# Altium schematic sheet JP_acc.SchDoc
size A4
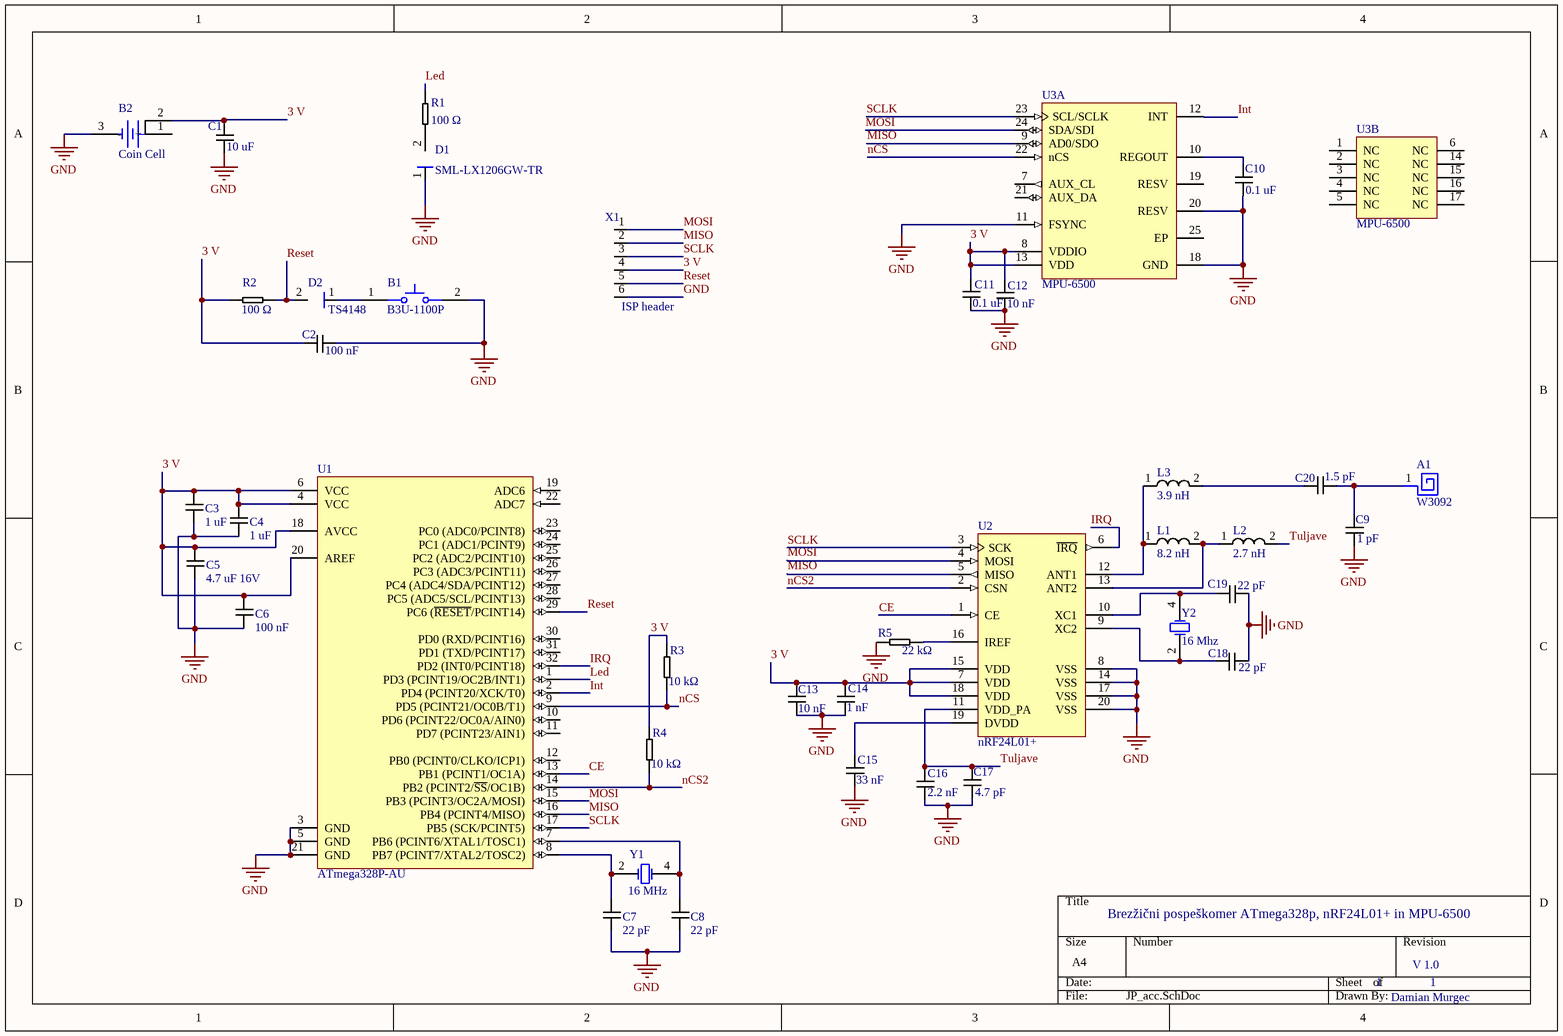
[diagram p0: JP_acc.SchDoc]

## Parts
A1  W3092  [Antenna]
B1  B3U-1100P  [Tactile Switch SMD]
B2  Coin Cell  [CR2032]
C1  10 uF  [0603 cap]
C2  100 nF  [0603 cap]
C3  1 uF  [0603 cap]
C4  1 uF  [0603 cap]
C5  4.7 uF 16V  [0603 cap]
C6  100 nF  [0603 cap]
C7  22 pF  [0603 cap]
C8  22 pF  [0603 cap]
C9  1 pF  [0603 cap]
C10  0.1 uF  [0603 cap]
C11  0.1 uF  [0603 cap]
C12  10 nF  [0603 cap]
C13  10 nF  [0603 cap]
C14  1 nF  [0603 cap]
C15  33 nF  [0603 cap]
C16  2.2 nF  [0603 cap]
C17  4.7 pF  [0603 cap]
C18  22 pF  [0603 cap]
C19  22 pF  [0603 cap]
C20  1.5 pF  [0603 cap]
D1  SML-LX1206GW-TR  [1206 Led]
D2  TS4148  [Diode 0808]
L1  8.2 nH  [0603 Inductor]
L2  2.7 nH  [0603 Inductor]
L3  3.9 nH  [0603 Inductor]
R1  100 Ω  [0603 res]
R2  100 Ω  [0603 res]
R3  10 kΩ  [0603 res]
R4  10 kΩ  [0603 res]
R5  22 kΩ  [0603 res]
U1  ATmega328P-AU  [TQFP32]
U2  nRF24L01+  [QFN20]
U3  MPU-6500  [QFN24]  (parts A,B of 2)
X1  ISP header  [2pins]
Y1  16 MHz  [OSC]
Y2  16 Mhz  [OSC]

## Nets
GND: B1.2 B2.3(-) C1.1 C2.2 C3.1 C4.1 C5.1 C6.1 C7.1 C8.1 C9.1 C10.1 C11.1 C12.1 C13.1 C14.1 C15.1 C16.1 C17.1 C18.2 C19.2 D1.1 R5.2 U1.3(GND) U1.5(GND) U1.21(GND) U2.8(VSS) U2.14(VSS) U2.17(VSS) U2.20(VSS) U3.11(FSYNC) U3.18(GND) U3.20(RESV) X1.6
3 V: B2.2 C1.2 C2.1 C3.2 C4.2 C5.2 C6.2 C11.2 C12.2 C13.2 C14.2 R2.2 R3.1 R4.1 U1.4(VCC) U1.6(VCC) U1.18(AVCC) U1.20(AREF) U2.7(VDD) U2.15(VDD) U2.18(VDD) U3.8(VDDIO) U3.13(VDD) X1.4
CE: U1.13(PB1_(PCINT1/OC1A)) U2.1(CE)
Int: U1.2(PD4_(PCINT20/XCK/T0)) U3.12(INT)
IRQ: U1.32(PD2_(INT0/PCINT18)) U2.6(~{IRQ})
Led: R1.1 U1.1(PD3_(PCINT19/OC2B/INT1))
MISO: U1.16(PB4_(PCINT4/MISO)) U2.5(MISO) U3.9(AD0/SDO) X1.2
MOSI: U1.15(PB3_(PCINT3/OC2A/MOSI)) U2.4(MOSI) U3.24(SDA/SDI) X1.1
nCS: R3.2 U1.9(PD5_(PCINT21/OC0B/T1)) U3.22(nCS)
nCS2: R4.2 U1.14(PB2_(PCINT2/~{SS}/OC1B)) U2.2(CSN)
Reset: D2.2 R2.1 U1.29(PC6_(~{RESET}/PCINT14)) X1.5
SCLK: U1.17(PB5_(SCK/PCINT5)) U2.3(SCK) U3.23(SCL/SCLK) X1.3
Tuljave: C16.2 C17.2 L2.2 U2.11(VDD_PA)
NetA1_1: A1.1 C9.2 C20.1
NetB1_1: B1.1 D2.1
NetC7_2: C7.2 U1.8(PB7_(PCINT7/XTAL2/TOSC2)) Y1.2(X1)
NetC8_2: C8.2 U1.7(PB6_(PCINT6/XTAL1/TOSC1)) Y1.4(X2)
NetC10_2: C10.2 U3.10(REGOUT)
NetC15_2: C15.2 U2.19(DVDD)
NetC18_1: C18.1 U2.9(XC2) Y2.2(X1)
NetC19_1: C19.1 U2.10(XC1) Y2.4(X2)
NetC20_2: C20.2 L3.2
NetD1_2: D1.2 R1.2
NetL1_1: L1.1 L3.1 U2.12(ANT1)
NetL1_2: L1.2 L2.1 U2.13(ANT2)
NetR5_1: R5.1 U2.16(IREF)

Not connected (* = marked no-connect by the designer): B2 1(+); U1 10(PD6_(PCINT22/OC0A/AIN0)) 11(PD7_(PCINT23/AIN1)) 12(PB0_(PCINT0/CLKO/ICP1)) 19(ADC6) 22(ADC7) 23(PC0_(ADC0/PCINT8)) 24(PC1_(ADC1/PCINT9)) 25(PC2_(ADC2/PCINT10)) 26(PC3_(ADC3/PCINT11)) 27(PC4_(ADC4/SDA/PCINT12)) 28(PC5_(ADC5/SCL/PCINT13)) 30(PD0_(RXD/PCINT16)) 31(PD1_(TXD/PCINT17)); U3 1(NC) 2(NC) 3(NC) 4(NC) 5(NC) 6(NC) 7(AUX_CL) 14(NC) 15(NC) 16(NC) 17(NC) 19(RESV) 21(AUX_DA) 25(EP)

## Notes on the sheet
- Brezžični pospeškomer ATmega328p, nRF24L01+ in MPU-6500
- 1
- V 1.0
- Damian Murgec

## Library data of the parts
A1 = Antenna
B1 = Botton: B3U-1100P series; ComponentLink1Description: Datasheet; ComponentLink1URL: https://omronfs.omron.com/en_US/ecb/products/pdf/en-b3u.pdf
C1-C9 C17-C20 = Capacitor
C10 = Capacitor: 2V, X7R +-10%
C11 C12 = Capacitor: 4V, X7R +-10%
C13-C16 = Capacitor: X7R +-10%
D1 D2 = Diode
L1-L3 = Inductor
R1-R5 = Resistor
X1 = 6pin
Y1 Y2 = Osc: 16 MHz, 3 x 2.5